# EasyEDA Pro project 前车mainboard_V3.2.epro

# Schematic mainboard_V3.2
Board Name: mainboard_V3.2; Create Date: 2025-04-06; Page Name: P1; Project Name: 主板（前车）; Schematic Name: mainboard_V3.2; Update Date: 2025-04-06; Company: 嘉立创EDA; Page Size: A4; Version: V1.0
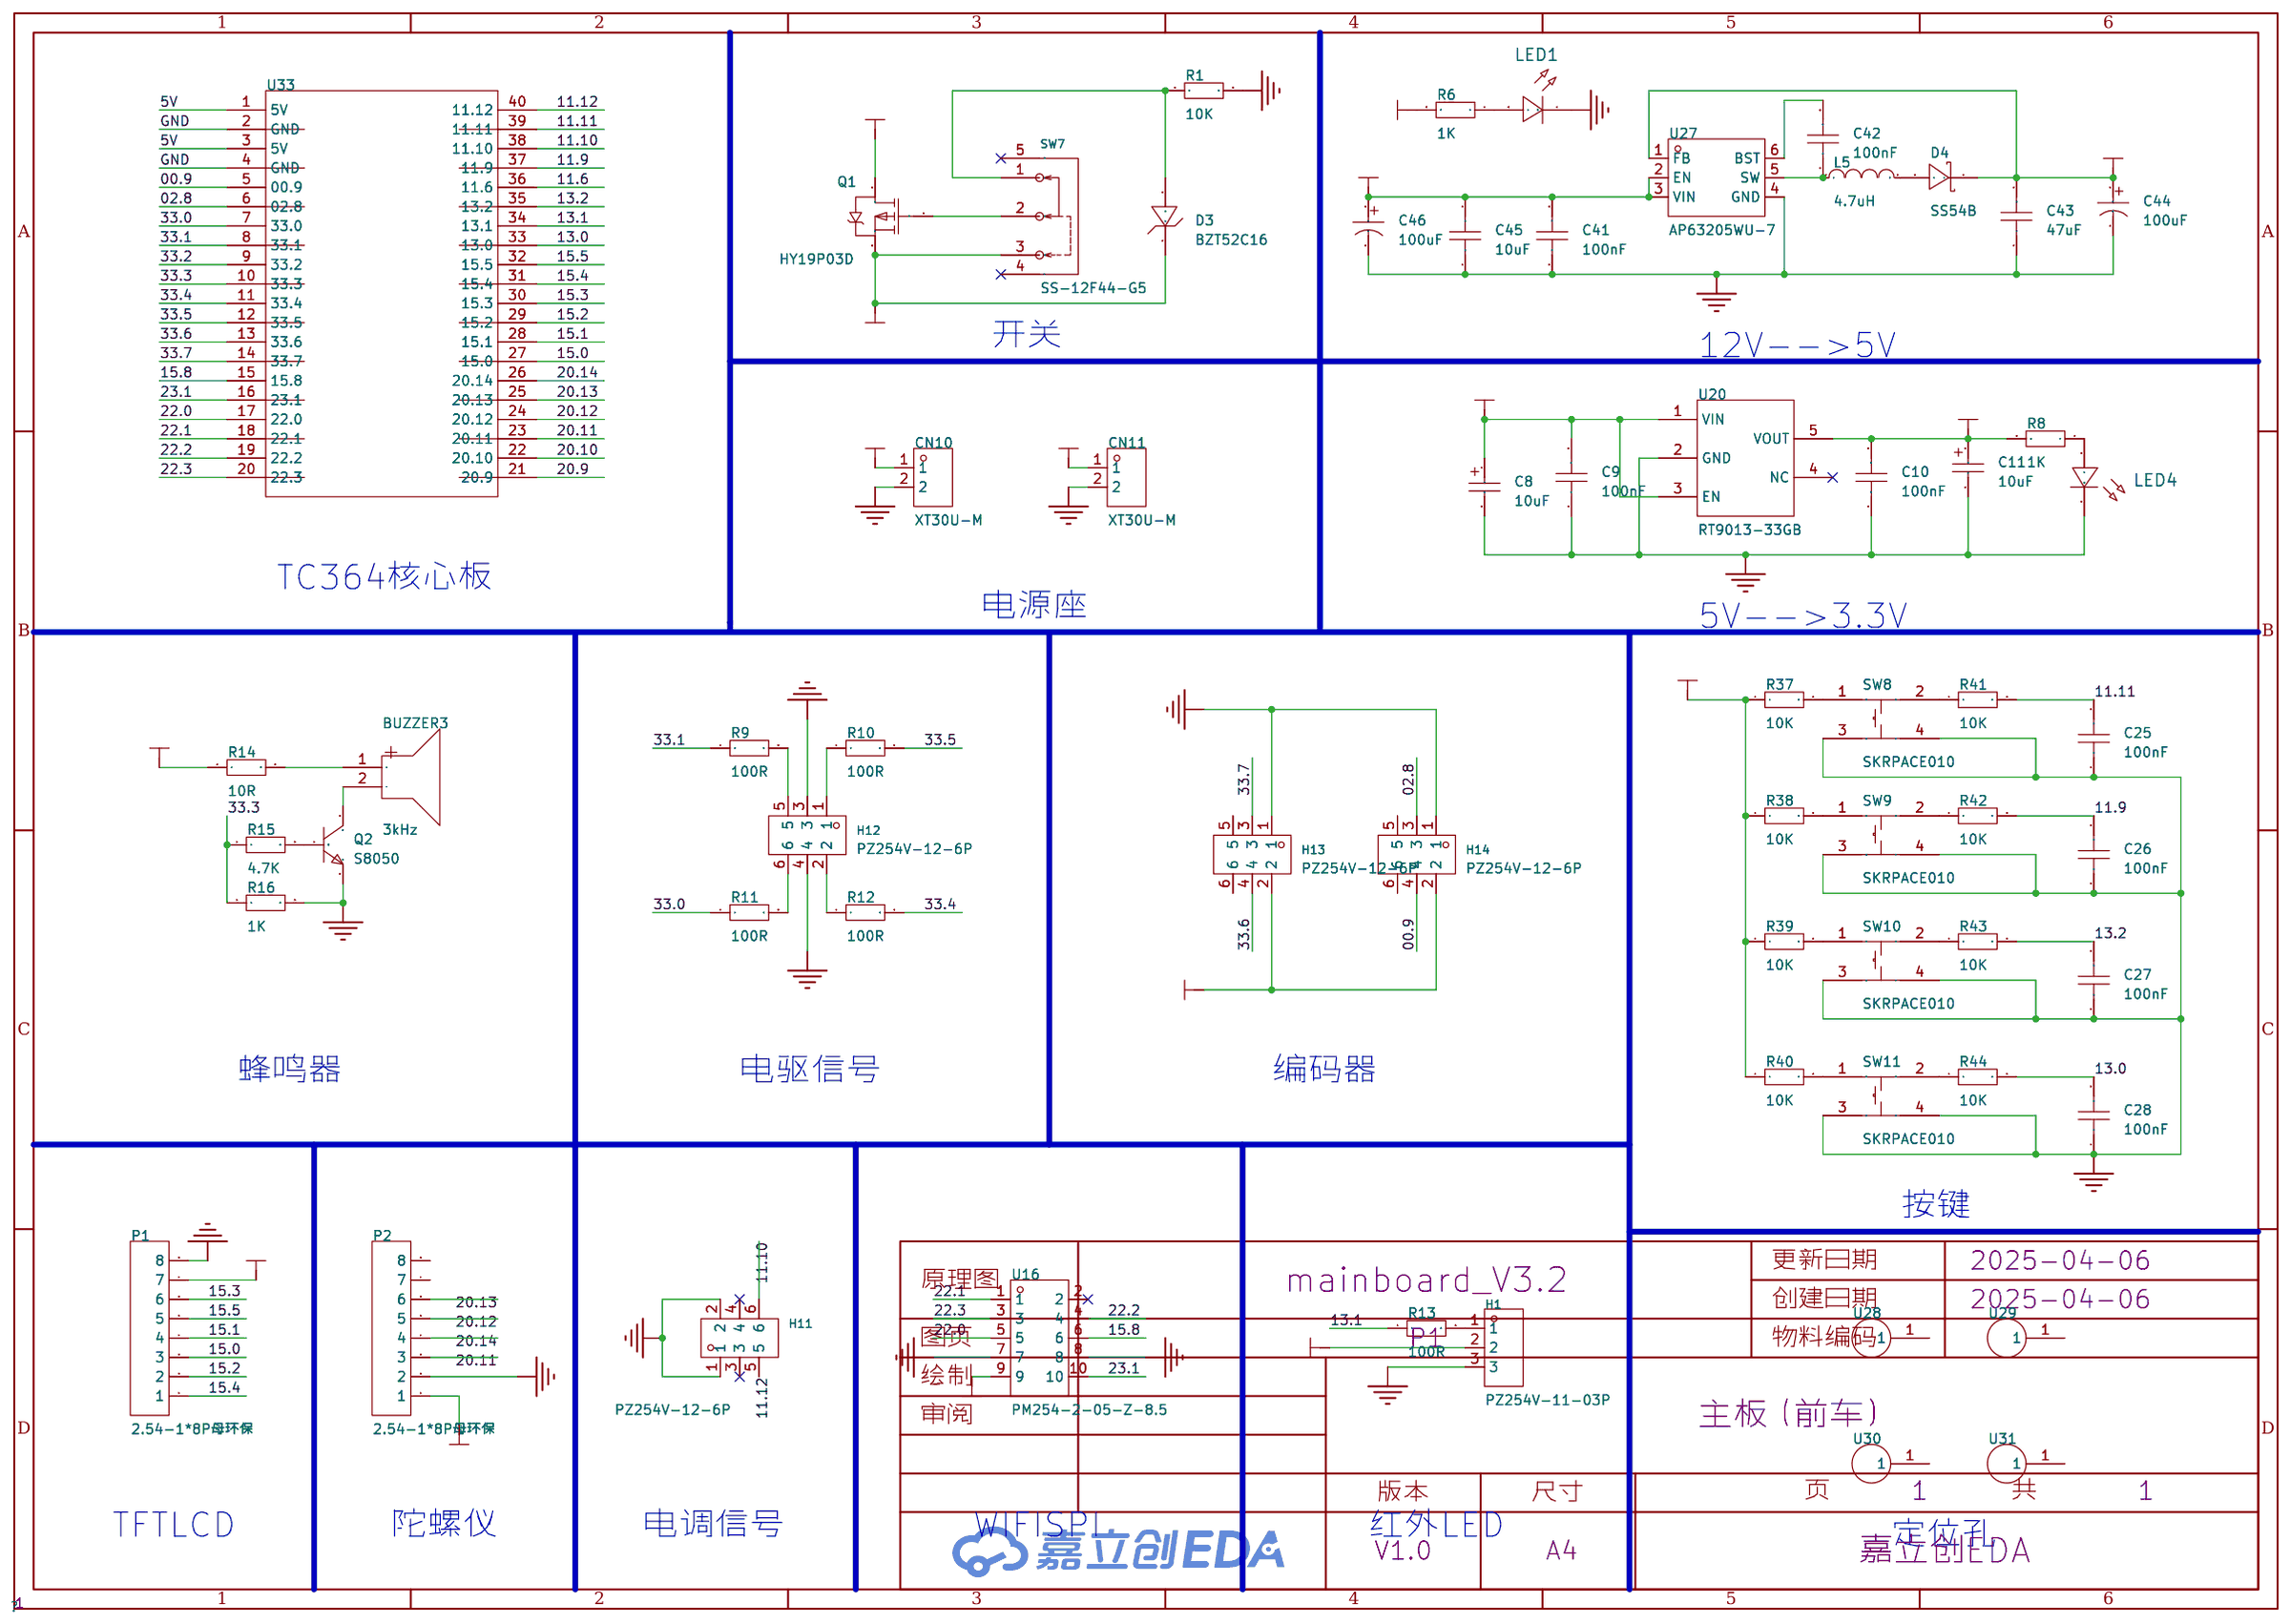
[diagram p0: schematic sheet]

## Parts
BUZZER3  3kHz  [BUZ-TH_BD9.0-P5.00-D0.6-FD]
C8  10uF  [CAP-SMD_L3.2-W1.6-RD-C7171]
C9  100nF  [C0603]
C10  100nF  [C0603]
C11  10uF  [CAP-SMD_L3.2-W1.6-RD-C7171]
C25  100nF  [C0603]
C26  100nF  [C0603]
C27  100nF  [C0603]
C28  100nF  [C0603]
C41  100nF  [C0603]
C42  100nF  [C0603]
C43  47uF  [C0805]
C44  100uF  [CAP-TH_BD6.3-P2.50-D1.0-FD]
C45  10uF  [C0603]
C46  100uF  [CAP-TH_BD6.3-P2.50-D1.0-FD]
CN10  XT30U-M  [CONN-TH_XT30U-M]
CN11  XT30U-M  [CONN-TH_XT30U-M]
D3  BZT52C16  [SOD-123_L2.7-W1.6-LS3.7-RD]
D4  SS54B  [SMB_L4.6-W3.6-LS5.3-RD]
H1  PZ254V-11-03P  [HDR-TH_3P-P2.54-V-M]
H11  PZ254V-12-6P  [HDR-TH_6P-P2.54-V-M-R2-C3-S2.54]
H12  PZ254V-12-6P  [HDR-TH_6P-P2.54-V-M-R2-C3-S2.54]
H13  PZ254V-12-6P  [HDR-TH_6P-P2.54-V-M-R2-C3-S2.54]
H14  PZ254V-12-6P  [HDR-TH_6P-P2.54-V-M-R2-C3-S2.54]
L5  4.7uH  [IND-SMD_L7.0-W6.6]
LED1  -  [LED_0603]
LED4  -  [LED_0603]
P1  2.54-1*8P母环保  [HDR-TH_8P-P2.54-V-F-1]
P2  2.54-1*8P母环保  [HDR-TH_8P-P2.54-V-F-1]
Q1  HY19P03D  [TO-252-2_L6.6-W6.1-P4.57-LS9.9-TL-CW]
Q2  S8050  [SOT-23-3_L2.9-W1.3-P1.90-LS2.4-BR]
R1  10K  [R0603]
R6  1K  [R0603]
R8  1K  [R0603]
R9  100R  [R0603]
R10  100R  [R0603]
R11  100R  [R0603]
R12  100R  [R0603]
R13  100R  [R0603]
R14  10R  [R0603]
R15  4.7K  [R0603]
R16  1K  [R0603]
R37  10K  [R0603]
R38  10K  [R0603]
R39  10K  [R0603]
R40  10K  [R0603]
R41  10K  [R0603]
R42  10K  [R0603]
R43  10K  [R0603]
R44  10K  [R0603]
SW7  SS-12F44-G5  [SW-TH_SS-12F44-G5]
SW8  SKRPACE010  [KEY-SMD_4P-L4.2-W3.2-P2.20-LS4.6]
SW9  SKRPACE010  [KEY-SMD_4P-L4.2-W3.2-P2.20-LS4.6]
SW10  SKRPACE010  [KEY-SMD_4P-L4.2-W3.2-P2.20-LS4.6]
SW11  SKRPACE010  [KEY-SMD_4P-L4.2-W3.2-P2.20-LS4.6]
U16  PM254-2-05-Z-8.5  [HDR-TH_10P-P2.54-V-F-R2-C5-S2.54]
U20  RT9013-33GB  [SOT-23-5_L3.0-W1.7-P0.95-LS2.8-BL]
U27  AP63205WU-7  [TSOT-23-6_L2.9-W1.6-P0.95-LS2.8-BL]
U28  -  [M3螺丝孔]  (no BOM)
U29  -  [M3螺丝孔]  (no BOM)
U30  -  [M3螺丝孔]  (no BOM)
U31  -  [M3螺丝孔]  (no BOM)
U33  -  [TC364_CoreBoard_V3.0]

## Library data of the parts
BUZZER3 = HNB09A03: 驱动方式:有源(内含驱动线路);构造类型:电磁式;频率:3kHz;声压(SPL):85dB@10cm;; LCSC Part Name: 电磁式有源一体蜂鸣器HNB09A03; Supplier Part: C96102; Manufacturer: 华能; Supplier Footprint: 插件,D=9mm; JLCPCB Part Class: 扩展库; Datasheet: https://atta.szlcsc.com/upload/public/pdf/source/20170522/1495448326172.pdf; Supplier: LCSC; Oscillator Circuit: 有源(内含驱动线路); Technology Type: 电磁式; Operating Voltage: 1.5V~4.5V; Current Consumption: 30mA; Sound Pressure Level (SPL): 85dB@10cm; Diameter (φD): 9mm; Height: 5.5mm; Operating Temperature: -20℃~+70℃
C8 C11 = TAJA106K016RNJ: 容值:10uF;精度:±10%;额定电压:16V;等效串联电阻:3Ω@100kHz;; LCSC Part Name: 10uF ±10% 16V; Supplier Part: C7171; Manufacturer: Kyocera AVX; Supplier Footprint: CASE-A-3216; JLCPCB Part Class: 基础库; Datasheet: https://atta.szlcsc.com/upload/public/pdf/source/20160107/1457707750344.pdf; Supplier: LCSC; Tolerance: ±10%; Rated Voltage: 16V; Equivalent Series Resistance(ESR): 3Ω@100kHz; Operating Temperature: -55℃~+125℃
C9 C10 = CC0603KRX7R9BB104: 容值:100nF;精度:±10%;额定电压:50V;材质(温度系数):X7R;; LCSC Part Name: 100nF ±10% 50V; Supplier Part: C14663; Manufacturer: YAGEO(国巨); Supplier Footprint: 0603; JLCPCB Part Class: 基础库; Datasheet: https://atta.szlcsc.com/upload/public/pdf/source/20180910/C282072_33301C7F631E79921B82A8DAC6BCC5B3.pdf; Supplier: LCSC; Tolerance: ±10%; Voltage Rated: 50V; Temperature Coefficient: X7R
C25-C28 C41 C42 C45 = CAP_0603: Supplier Footprint: 0603
C43 = CGA0805X5R476M100MT: 容值:47uF;精度:±20%;额定电压:10V;材质(温度系数):X5R;; LCSC Part Name: 47uF ±20% 10V; Supplier Part: C6119904; Manufacturer: HRE(芯声); Supplier Footprint: 0805; JLCPCB Part Class: 扩展库; Supplier: LCSC; Tolerance: ±20%; Voltage Rated: 10V; Temperature Coefficient: X5R
C44 C46 = SPZ1VM101E08O00RAXXX: 容值:100uF;精度:±20%;额定电压:35V;纹波电流:2.35A@100kHz;等效串联电阻:50mΩ@100kHz;类型:-;; LCSC Part Name: 100uF ±20% 35V; Supplier Part: C122240; Manufacturer: AISHI(艾华集团); Supplier Footprint: 插件,D6.3xL8mm; JLCPCB Part Class: 扩展库; Datasheet: https://atta.szlcsc.com/upload/public/pdf/source/20170721/C122240_1500619276730834029.pdf; Supplier: LCSC; Tolerance: ±20%; Rated Voltage: 35V; Ripple Current: 2.35A@100kHz; Equivalent Series Resistance(ESR): 50mΩ@100kHz; Lead Spacing: 2.5mm; φD: 6.3mm; L: 8mm; Lifetime @ Temp: 2000hrs@105℃; Operating Temperature: -55℃~+105℃
CN10 CN11 = XT30U-M: 类别:-;类型1:-;; LCSC Part Name: AMASS(艾迈斯)轻量版锂电池插头公头 XT30U-M; Supplier Part: C99101; Manufacturer: AMASS(艾迈斯); JLCPCB Part Class: 扩展库; Datasheet: https://atta.szlcsc.com/upload/public/pdf/source/20170606/1496716542582.pdf; Supplier: LCSC; Brand: 艾迈斯; Type: 插头; Colour: 黄色; InterfaceType: 公头
D3 = BZT52C16_C266570: 二极管配置:独立式;稳压值(标称值):16V;稳压值(范围):15.3V~17.1V;功率:500mW;精度:-;; Supplier Part: C266570; Manufacturer: BORN(伯恩半导体); Supplier Footprint: SOD-123; JLCPCB Part Class: 扩展库; Datasheet: https://atta.szlcsc.com/upload/public/pdf/source/20180820/C271262_D2D0F24DD5A81EAE2A6B8B493A94E64A.pdf; Supplier: LCSC; Diode Configuration: 独立式; Zener Voltage (Nom): 16V; Reverse Leakage Current (Ir): 100nA@11.2V; Zener Voltage (Range): 15.3V~17.1V; Power Dissipation: 500mW; Zener Impedance (Zzt): 40Ω
D4 = SS54B_C32513: 二极管配置:独立式;正向压降(Vf):550mV@5A;直流反向耐压(Vr):40V;整流电流:5A;; LCSC Part Name: 电压:40V 电流:5A; Supplier Part: C32513; Manufacturer: MDD(辰达半导体); Supplier Footprint: SMB(DO-214AA); JLCPCB Part Class: 扩展库; Datasheet: https://atta.szlcsc.com/upload/public/pdf/source/20240729/11D094B8AB06134CE012673FC230C171.pdf; Supplier: LCSC; Diode Configuration: 独立式; Forward Voltage (Vf@If): 550mV@5A; Reverse Voltage (Vr): 40V; Rectified Current: 5A; Reverse Leakage Current (Ir): 1mA@40V
H1 = PZ254V-11-03P: 排数:单排;总PIN位数:3;间距:2.54mm;插针结构:1x3P;行距:-;安装类型:直插;圆针/方针:方针;额定电流:3A;额定电压:250V;配合针长度:6mm;塑高:2.5mm;端接针长度:3mm;工作温度范围:-40℃~+105℃;颜色:黑色;; LCSC Part Name: 2.54mm 1x3P 直插 方针; Supplier Part: C2937625; Manufacturer: XFCN(兴飞); Supplier Footprint: 直插,P=2.54mm; JLCPCB Part Class: 扩展库; Datasheet: 2022-07-12/581362A/62b9d00620994b3696be7eb4af85ad72/双排排针和单排排针.pdf; Supplier: LCSC; Number of Rows: 单排; Number of Pins: 3; Pitch: 2.54mm; Pin Structure: 1x3P; Mounting Type: 直插; Circluar Pins/Square Pins: 方针; Current Rating (Max): 3A; Voltage Rating (Max): 250V; Length of Mating Pin: 6mm; Insulation Height: 2.5mm; Length of End Connection Pin: 3mm; Operating Temperature Range: -40℃~+105℃; Color: 黑色
H11-H14 = PZ254V-12-6P: 排数:双排;总PIN位数:6P;间距:2.54mm;插针结构:2x3P;行距:2.54mm;安装类型:直插;圆针/方针:方针;额定电流:-;额定电压:-;配合针长度:6mm;塑高:2.5mm;端接针长度:3mm;触头材质:黄铜;触头镀层:-;工作温度范围:-40℃~+105℃;颜色:黑色;; LCSC Part Name: 2.54mm 2x3P 直插 方针; Supplier Part: C492420; Manufacturer: XFCN(兴飞); Supplier Footprint: 插件,P=2.54mm; JLCPCB Part Class: Extended Part; Datasheet: https://atta.szlcsc.com/upload/public/pdf/source/20200309/C492420_BAECB307B001054C09D200388220EAE6.pdf; Supplier: LCSC; Number of Rows: 双排; Number of Pins: 6P; Pitch: 2.54mm; Pin Structure: 2x3P; Row Spacing: 2.54mm; Mounting Type: 直插; Circluar Pins/Square Pins: 方针; Length of Mating Pin: 6mm; Insulation Height: 2.5mm; Length of End Connection Pin: 3mm; Contact Material: 黄铜; Operating Temperature Range: -40℃~+105℃; Color: 黑色
L5 = FXL0630-4R7-M: 电感值:4.7uH;精度:±20%;额定电流:6A;饱和电流(Isat):9A;类型:一体成型电感;; LCSC Part Name: 4.7uH ±20% 9A; Supplier Part: C167220; Manufacturer: cjiang(长江微电); Supplier Footprint: SMD,6.6x7mm; JLCPCB Part Class: Extended Part; Datasheet: https://atta.szlcsc.com/upload/public/pdf/source/20240426/3189EA8206330E2108542F9E34E540E7.pdf; Supplier: LCSC; Tolerance: ±20%; Rated Current: 6A; Saturation Current (Isat): 9A; DC Resistance (DCR): 33mΩ; Type: 一体成型电感
LED1 LED4 = LED_0603-R: Supplier Footprint: 0603
P1 P2 = 2.54-1*8P母环保: 插孔结构:1x8P;间距:2.54mm;行距:-;安装类型:直插;排数:单排;总孔位数:8P;塑高:-;触头材质:-;触头镀层:-;; LCSC Part Name: 间距:2.54mm 1x8P 直插; Supplier Part: C27438; Manufacturer: BOOMELE(博穆精密); Supplier Footprint: 插件,P=2.54mm; JLCPCB Part Class: Extended Part; Datasheet: https://atta.szlcsc.com/upload/public/pdf/source/20231221/1CA800C6799ED97958773716FAA1BFFE.pdf; Supplier: LCSC; Holes Structure: 1x8P; Pitch: 2.54mm; Mounting Type: 直插; Number of Rows: 单排; Number of Holes: 8P
Q1 = HY19P03D: 类型:P沟道;漏源电压(Vdss):30V;连续漏极电流(Id):90A;功率(Pd):50W;导通电阻(RDS(on)@Vgs,Id):6mΩ@10V,45A;阈值电压(Vgs(th)@Id):3V@250uA;; LCSC Part Name: P沟道 30V 90A; Supplier Part: C122492; Manufacturer: HUAYI(华羿微); Supplier Footprint: TO-252-2; JLCPCB Part Class: 扩展库; Datasheet: https://atta.szlcsc.com/upload/public/pdf/source/20170728/C122492_1501225751911848809.pdf; Supplier: LCSC; Type: P沟道; Drain Source Voltage (Vdss): 30V; Continuous Drain Current (Id): 90A; Power Dissipation (Pd): 50W; Drain Source On Resistance (RDS(on)@Vgs,Id): 6mΩ@10V,45A; Gate Threshold Voltage (Vgs(th)@Id): 3V@250uA
Q2 = S8050_C2891804: 晶体管类型:NPN;集电极电流(Ic):500mA;集射极击穿电压(Vceo):25V;功率(Pd):300mW;; LCSC Part Name: 耐压:25V 电流:500mA NPN; Supplier Part: C2891804; Manufacturer: YONGYUTAI(永裕泰); Supplier Footprint: SOT-23; JLCPCB Part Class: 扩展库; Datasheet: https://atta.szlcsc.com/upload/public/pdf/source/20210901/5347316A10609C628D4D69AE01446E5B.pdf; Supplier: LCSC; Transistor Type: NPN; Collector Current (Ic): 500mA; Collector-Emitter Breakdown Voltage (Vceo): 25V; Power Dissipation (Pd): 300mW; Collector Cut-Off Current (Icbo): 1uA; Collector-Emitter Saturation Voltage (VCE(sat)@Ic,Ib): 500mV@500mA,50mA; Operating Temperature: +150℃@(Tj)
R1 R6 R8-R16 R37-R44 = Res_0603: Supplier Footprint: 0603
SW7 = SS-12F44-G5_C136718: 额定电流(DC):-;额定电压(DC):-;额定电流(AC):-;额定电压(AC):-;电路结构:单刀双掷;安装方式:直插;机械寿命:5千次;; LCSC Part Name: 直插双档 滑动开关; Supplier Part: C136718; Manufacturer: 韩国韩荣; Supplier Footprint: 插件; JLCPCB Part Class: 扩展库; Datasheet: https://atta.szlcsc.com/upload/public/pdf/source/20171123/C136718_15114108132111137440.pdf; Supplier: LCSC; Circuit: 单刀双掷; Mounting Style: 直插; Mechanical Life: 5千次; Actuator Style: 矩形柱状; Pin Style: PC引脚; Operating Temperature: -25℃~+70℃; Switch Height: 11mm
SW8-SW11 = SKRPACE010: 电路结构:单刀单掷;按钮形状:椭圆形按钮;安装方式:立贴;开关长度:4.2mm;开关宽度:3.2mm;开关高度:2.5mm;触点电流:50mA;额定电压(DC):16V;带灯:-;机械寿命:-;; LCSC Part Name: 4.2*3.2*2.5mm 立贴 轻触开关; Supplier Part: C139797; Manufacturer: ALPSALPINE(阿尔卑斯阿尔派); Supplier Footprint: SMD; JLCPCB Part Class: 扩展库; Datasheet: https://atta.szlcsc.com/upload/public/pdf/source/20171113/C139797_15105612676371115729.pdf; Supplier: LCSC; Circuit: 单刀单掷; Actuator Style: 椭圆形按钮; Mounting Style: 立贴; Switch Length: 4.2mm; Switch Width: 3.2mm; Switch Height: 2.5mm; Contact Current: 50mA; Voltage Rating (DC): 16V
U16 = PM254-2-05-Z-8.5: 排数:双排;总孔位数:10P;间距:2.54mm;插孔结构:2x5P;行距:2.54mm;安装类型:直插;圆孔/方孔:方孔;额定电流:3A;额定电压:-;插孔方向:顶部;塑高:8.5mm;工作温度范围:-40℃~+105℃;; LCSC Part Name: 间距:2.54mm 2x5P 直插; Supplier Part: C2897406; Manufacturer: HCTL(华灿天禄); Supplier Footprint: 插件,P=2.54mm; JLCPCB Part Class: 扩展库; Datasheet: https://atta.szlcsc.com/upload/public/pdf/source/20230609/3D36CA2C1BFC9FD1C3F709AD9DFEB9C2.pdf; Supplier: LCSC; Number of Rows: 双排; Number of Holes: 10P; Pitch: 2.54mm; Holes Structure: 2x5P; Row Spacing: 2.54mm; Mounting Type: 直插; Circular Hole / Square Hole: 方孔; Current Rating (Max): 3A; Holes Direction: 顶部; Insulation Height: 8.5mm; Operating Temperature Range: -40℃~+105℃
U20 = RT9013-33GB: 输出类型:固定;输出极性:正;最大输入电压:5.5V;输出电压:3.3V;输出电流:500mA;电源纹波抑制比(PSRR):50dB@(10kHz);; LCSC Part Name: 输入5.5V 输出3.3V 500mA; Supplier Part: C47773; Manufacturer: RICHTEK(立锜); Supplier Footprint: SOT-23-5; JLCPCB Part Class: 扩展库; Datasheet: https://atta.szlcsc.com/upload/public/pdf/source/20150504/1457707282459.pdf; Supplier: LCSC; Output Type: 固定; Output Polarity: 正; Number of Outputs: 1; Maximum Input Voltage: 5.5V; Output Voltage: 3.3V; Dropout Voltage: 400mV@(500mA); Quiescent Current (Ground Current): 50uA; Output Current: 500mA; Power Supply Rejection Ratio (PSRR): 50dB@(10kHz); Operating Temperature: -40℃~+85℃
U27 = AP63205WU-7: 功能类型:降压型;输出类型:固定;输入电压:3.8V~32V;输出电压:5V;输出电流:2A;; LCSC Part Name: 3.8V至32V输入、2A低静态电流同步降压转换器，增强EMI抑制; Supplier Part: C2071056; Manufacturer: DIODES(美台); Supplier Footprint: TSOT-23-6; JLCPCB Part Class: 扩展库; Datasheet: https://atta.szlcsc.com/upload/public/pdf/source/20210622/C780769_099C67289BD3EC61AAFB52D8B07125B3.pdf; Supplier: LCSC; Function: 降压型; Output Type: 固定; Input Voltage: 3.8V~32V; Output Voltage: 5V; Output Current: 2A; Switching Frequency: 1.1MHz; Operating Temperature: -40℃~+85℃@(TA); Synchronous Rectification: 是; Number of Outputs: 1; Topology: 降压式; Quiescent Current (Iq): 22uA; Switch tube (built-in/external): 内置
U28-U31 = M3螺丝孔
U33 = TC364_CoreBoard_V3.0

## Nets
3V3: C10.2 C11.1 H13.2 H14.2 P1.7 P2.1 R8.2 R14.1 R37.1 R38.1 R39.1 R40.1 U20.5(VOUT)
5V: C8.1 C9.2 C43.2 C44.1 D4.1(K) H1.2 R6.2 U16.9 U20.1(VIN) U20.3(EN) U27.1(FB) U33.1(5V) U33.3(5V)
GND: C8.2 C9.1 C10.1 C11.2 C25.1 C26.1 C27.1 C28.1 C41.1 C43.1 C44.2 C45.1 C46.2 CN10.2 CN11.2 H1.3 H11.1 H11.2 H12.3 H12.4 H13.1 H14.1 LED1.1(C) LED4.1(C) P1.8 P2.2 Q2.2(E) R1.2 R16.2 SW8.3 SW8.4 SW9.3 SW9.4 SW10.3 SW10.4 SW11.3 SW11.4 U16.7 U16.8 U20.2(GND) U27.4(GND) U33.2(GND) U33.4(GND)
VCCBAT: C41.2 C45.2 C46.1 CN11.1 Q1.2(D) U27.2(EN) U27.3(VIN)
VIN: CN10.1 D3.1 Q1.3(S) SW7.3
00.9: H14.4 U33.5(00.9)
02.8: H14.3 U33.6(02.8)
11.6: U33.36(11.6)
11.9: C26.2 R42.2 U33.37(11.9)
11.10: H11.6 U33.38(11.10)
11.11: C25.2 R41.2 U33.39(11.11)
11.12: H11.5 U33.40(11.12)
13.0: C28.2 R44.2 U33.33(13.0)
13.1: R13.1 U33.34(13.1)
13.2: C27.2 R43.2 U33.35(13.2)
15.0: P1.3 U33.27(15.0)
15.1: P1.4 U33.28(15.1)
15.2: P1.2 U33.29(15.2)
15.3: P1.6 U33.30(15.3)
15.4: P1.1 U33.31(15.4)
15.5: P1.5 U33.32(15.5)
15.8: U16.6 U33.15(15.8)
20.9: U33.21(20.9)
20.10: U33.22(20.10)
20.11: P2.3 U33.23(20.11)
20.12: P2.5 U33.24(20.12)
20.13: P2.6 U33.25(20.13)
20.14: P2.4 U33.26(20.14)
22.0: U16.5 U33.17(22.0)
22.1: U16.1 U33.18(22.1)
22.2: U16.4 U33.19(22.2)
22.3: U16.3 U33.20(22.3)
23.1: U16.10 U33.16(23.1)
33.0: R11.1 U33.7(33.0)
33.1: R9.1 U33.8(33.1)
33.2: U33.9(33.2)
33.3: R15.1 R16.1 U33.10(33.3)
33.4: R12.2 U33.11(33.4)
33.5: R10.2 U33.12(33.5)
33.6: H13.4 U33.13(33.6)
33.7: H13.3 U33.14(33.7)
$1N756: Q1.1(G) SW7.2
$1N757: D3.2 R1.1 SW7.1
$1N1936: LED4.2(A) R8.1
$1N2039: H1.1 R13.2
$1N2442: BUZZER3.1(+) R14.2
$1N2446: BUZZER3.2(-) Q2.3(C)
$1N2966: H12.5 R9.2
$1N2968: H12.1 R10.1
$1N2969: H12.6 R11.2
$1N2971: H12.2 R12.1
$1N3489: R37.2 SW8.1
$1N3490: R38.2 SW9.1
$1N3491: R39.2 SW10.1
$1N3492: R40.2 SW11.1
$1N3494: R42.1 SW9.2
$1N3495: R43.1 SW10.2
$1N3496: R44.1 SW11.2
$1N3497: R41.1 SW8.2
$1N3677: Q2.1(B) R15.2
$1N27934: LED1.2(A) R6.1
$1N27939: C42.1 L5.1 U27.5(SW)
$1N27940: C42.2 U27.6(BST)
$1N27942: D4.2(A) L5.2

Not connected (* = marked no-connect by the designer): H11 3* 4*; H13 5 6; H14 5 6; P2 7 8; SW7 4* 5*; U16 2*; U20 4(NC)*; U28 1; U29 1; U30 1; U31 1

## Notes on the sheet
- 开关
- 12V-->5V
- TC364核心板
- 电源座
- 5V-->3.3V
- 蜂鸣器
- 电驱信号
- 编码器
- 按键
- TFTLCD
- 陀螺仪
- 电调信号
- WIFISPI
- 红外LED
- 定位孔

# Board mainboard_V3.2
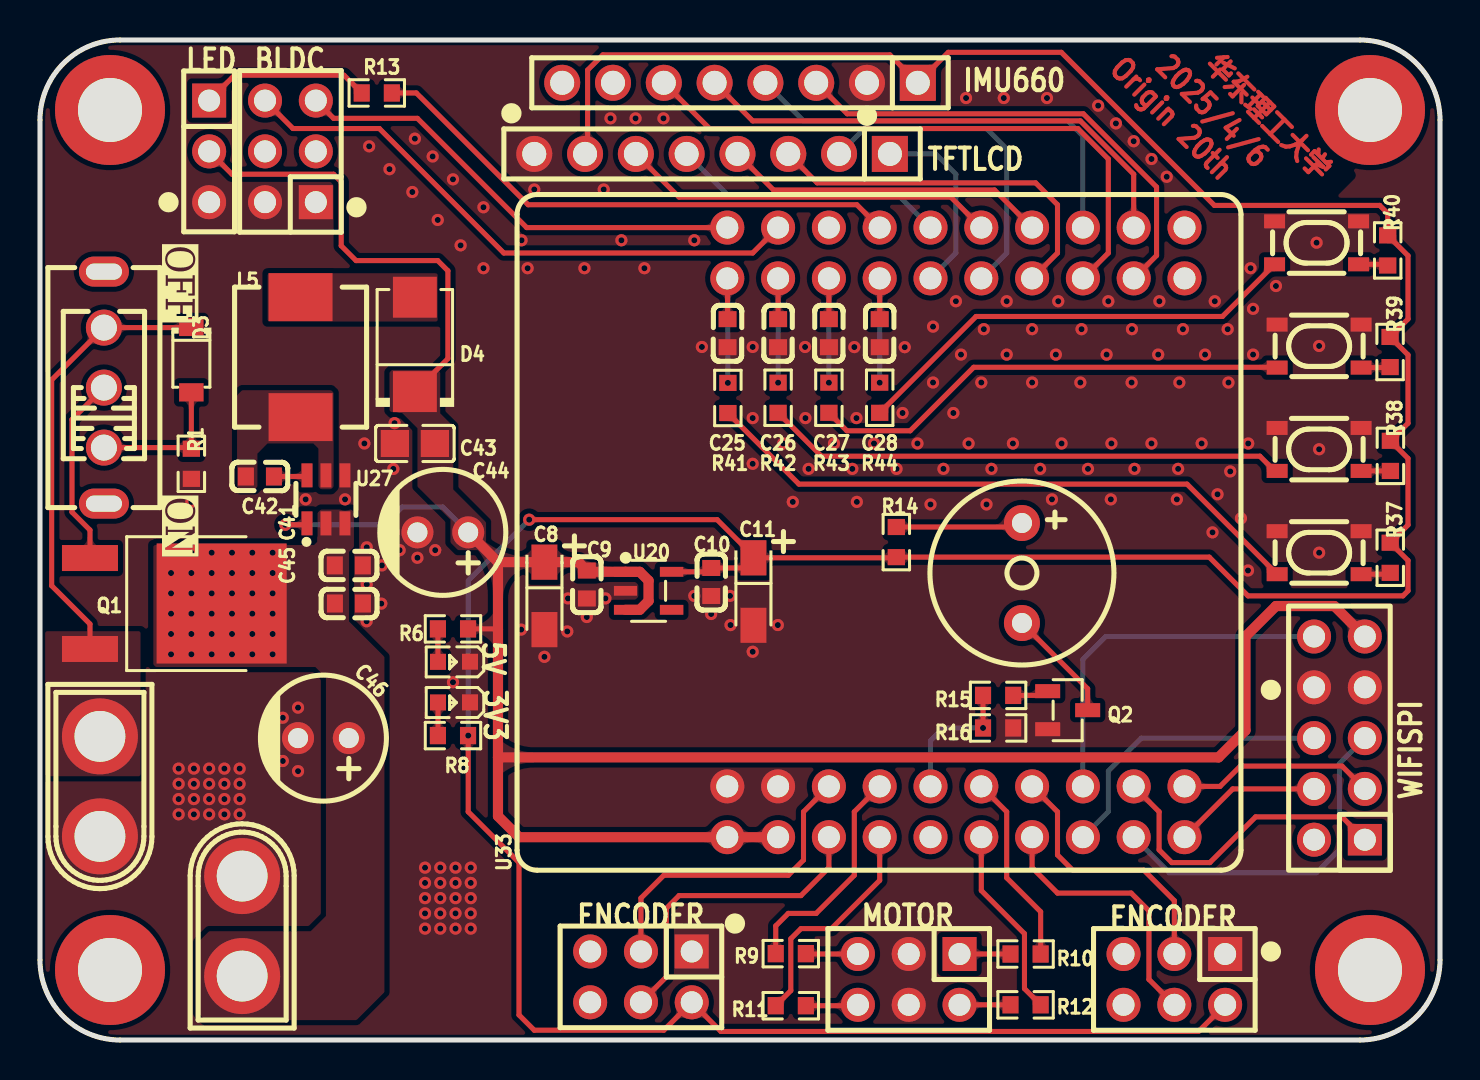
[diagram p1: board, top side]
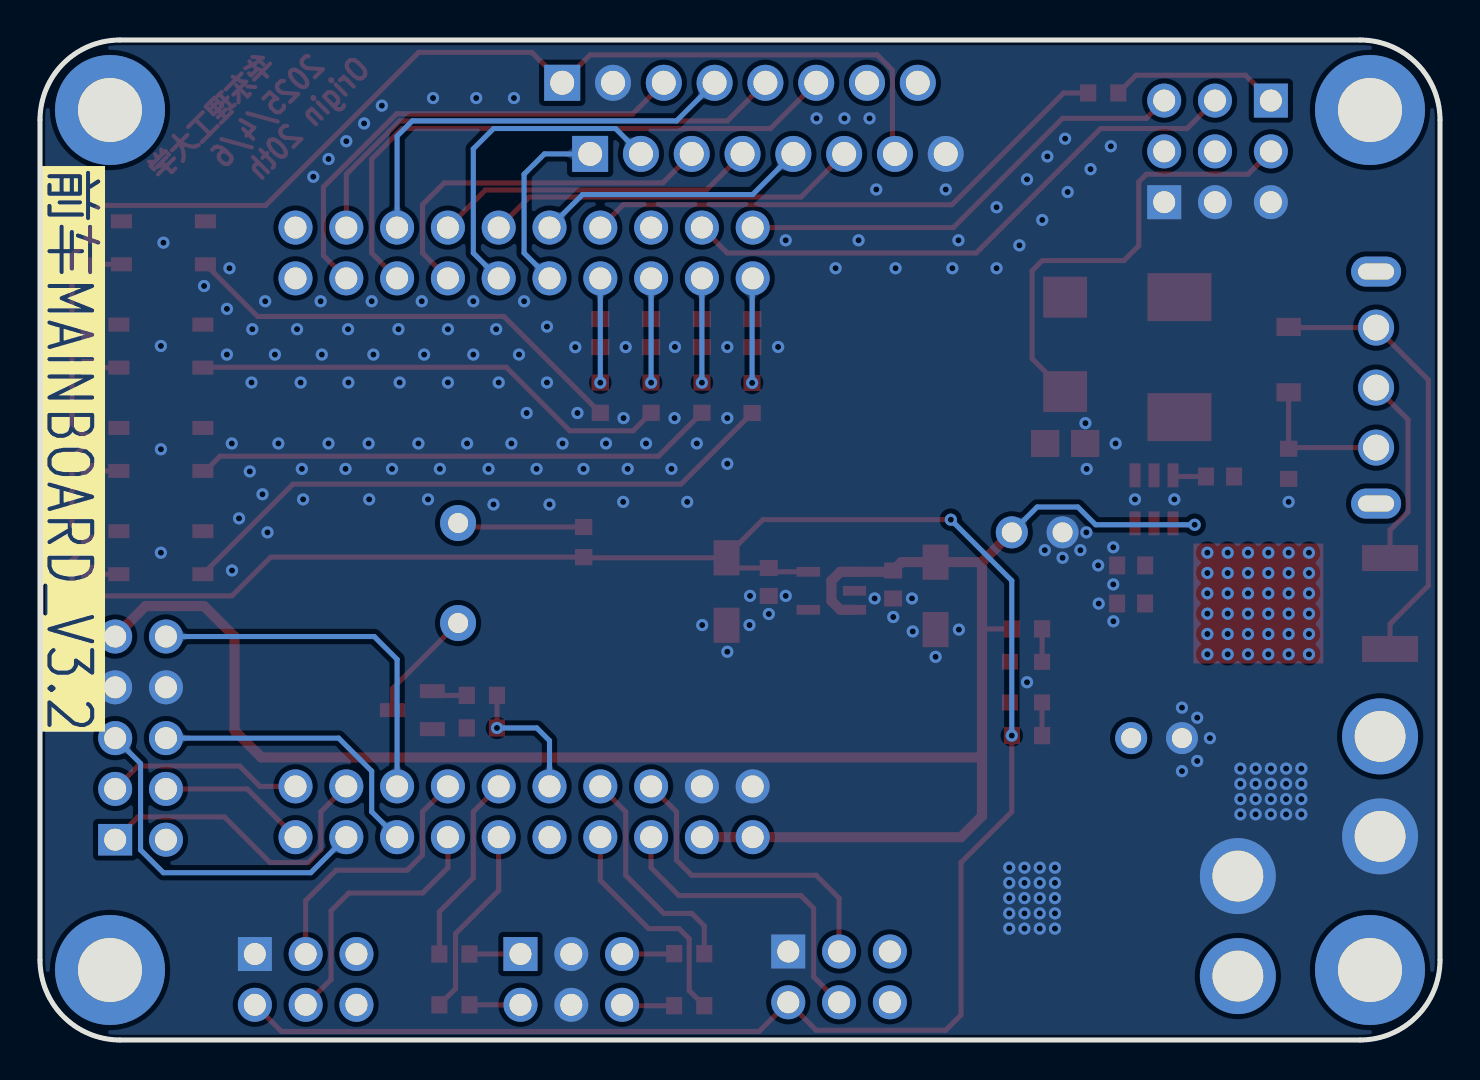
[diagram p2: board, bottom side, seen from below]

Outline 70 x 50 mm; copper layers: Top Layer, Bottom Layer. Coordinates in mm from the lower left corner of the outline.
Outline path: 0,46 0,4 arc(1.17,1.17) 4,0 66,0 arc(68.83,1.17) 70,4 70,46 arc(68.83,48.83) 66,50 4,50 arc(1.17,48.83) 0,46
Stack: Top Layer 0.035mm / Dielectric1 1.51mm FR4 er 4.5 / Bottom Layer 0.035mm

## Design rules (mm)
template: 4层
spacing copperThickness1oz (default): track to track 0.102, other pairs 0.152 to 0.3
spacing copperThickness2oz: track to track 0.203, other pairs 0.152 to 0.3
spacing copperThicknessInner0.5oz: track to track 0.089, other pairs 0.152 to 0.3
track width copperThickness1oz (default): min 0.102, default 0.254, max 2.54
track width copperThickness2oz: min 0.203, default 0.254, max 2.54
track width copperThickness0.5oz: min 0.089, default 0.254, max 2.54
differential pair differentialPair (default): width min 0.127, default 0.254, max 2.54; gap min 0.152, default 0.152
via viaSize (default): diameter min 0.3, default 0.61, max 10; hole min 0.2, default 0.305, max 6.3

## Placement (name value [footprint] x y rotation side)
BUZZER3  3kHz  [BUZ-TH_BD9.0-P5.00-D0.6-FD]  49.1 23.35 270 top
C8  10uF  [CAP-SMD_L3.2-W1.6-RD-C7171]  25.22 22.21 270 top
C9  100nF  [C0603]  27.34 22.77 90 top
C10  100nF  [C0603]  33.56 22.9 90 top
C11  10uF  [CAP-SMD_L3.2-W1.6-RD-C7171]  35.67 22.42 270 top
C25  100nF  [C0603]  34.38 35.34 90 top
C26  100nF  [C0603]  36.91 35.34 90 top
C27  100nF  [C0603]  39.44 35.34 90 top
C28  100nF  [C0603]  41.99 35.34 90 top
C41  100nF  [C0603]  15.44 23.73 180 top
C42  100nF  [C0603]  11 28.17 0 top
C43  47uF  [C0805]  18.74 29.83 0 top
C44  100uF  [CAP-TH_BD6.3-P2.50-D1.0-FD]  20.14 25.38 180 top
C45  10uF  [C0603]  15.44 21.83 180 top
C46  100uF  [CAP-TH_BD6.3-P2.50-D1.0-FD]  14.17 15.09 180 top
CN10  XT30U-M  [CONN-TH_XT30U-M]  3 12.68 270 top
CN11  XT30U-M  [CONN-TH_XT30U-M]  10.11 5.7 90 top
D3  BZT52C16  [SOD-123_L2.7-W1.6-LS3.7-RD]  7.57 34.02 270 top
D4  SS54B  [SMB_L4.6-W3.6-LS5.3-RD]  18.74 34.78 90 top
H1  PZ254V-11-03P  [HDR-TH_3P-P2.54-V-M]  8.46 44.43 270 top
H11  PZ254V-12-6P  [HDR-TH_6P-P2.54-V-M-R2-C3-S2.54]  12.52 44.43 90 top
H12  PZ254V-12-6P  [HDR-TH_6P-P2.54-V-M-R2-C3-S2.54]  43.44 3.03 180 top
H13  PZ254V-12-6P  [HDR-TH_6P-P2.54-V-M-R2-C3-S2.54]  56.72 3.03 180 top
H14  PZ254V-12-6P  [HDR-TH_6P-P2.54-V-M-R2-C3-S2.54]  30.05 3.16 180 top
L5  4.7uH  [IND-SMD_L7.0-W6.6]  13.03 34.14 90 top
LED1  -  [LED_0603]  20.65 18.9 180 top
LED4  -  [LED_0603]  20.65 16.87 180 top
P1  2.54-1*8P母环保  [HDR-TH_8P-P2.54-V-F-1]  33.6 44.3 180 top
P2  2.54-1*8P母环保  [HDR-TH_8P-P2.54-V-F-1]  35 47.86 180 top
Q1  HY19P03D  [TO-252-2_L6.6-W6.1-P4.57-LS9.9-TL-CW]  5.79 21.83 0 top
Q2  S8050  [SOT-23-3_L2.9-W1.3-P1.90-LS2.4-BR]  51.38 16.49 180 top
R1  10K  [R0603]  7.57 28.81 270 top
R6  1K  [R0603]  20.65 20.56 0 top
R8  1K  [R0603]  20.65 15.22 0 top
R9  100R  [R0603]  37.54 4.32 0 top
R10  100R  [R0603]  49.28 4.3 0 top
R11  100R  [R0603]  37.54 1.71 0 top
R12  100R  [R0603]  49.28 1.76 0 top
R13  100R  [R0603]  16.84 47.35 180 top
R14  10R  [R0603]  42.82 24.9 90 top
R15  4.7K  [R0603]  47.91 17.23 0 top
R16  1K  [R0603]  47.91 15.6 0 top
R37  10K  [R0603]  67.51 24.11 270 top
R38  10K  [R0603]  67.52 29.21 270 top
R39  10K  [R0603]  67.5 34.4 270 top
R40  10K  [R0603]  67.38 39.48 270 top
R41  10K  [R0603]  34.39 32.1 90 top
R42  10K  [R0603]  36.91 32.11 90 top
R43  10K  [R0603]  39.44 32.11 90 top
R44  10K  [R0603]  41.99 32.11 90 top
SW7  SS-12F44-G5  [SW-TH_SS-12F44-G5]  3.2 32.62 90 top
SW8  SKRPACE010  [KEY-SMD_4P-L4.2-W3.2-P2.20-LS4.6]  63.96 24.36 180 top
SW9  SKRPACE010  [KEY-SMD_4P-L4.2-W3.2-P2.20-LS4.6]  63.96 29.53 180 top
SW10  SKRPACE010  [KEY-SMD_4P-L4.2-W3.2-P2.20-LS4.6]  63.96 34.69 180 top
SW11  SKRPACE010  [KEY-SMD_4P-L4.2-W3.2-P2.20-LS4.6]  63.83 39.86 180 top
U16  PM254-2-05-Z-8.5  [HDR-TH_10P-P2.54-V-F-R2-C5-S2.54]  64.97 15.09 90 top
U20  RT9013-33GB  [SOT-23-5_L3.0-W1.7-P0.95-LS2.8-BL]  30.43 22.46 270 top
U27  AP63205WU-7  [TSOT-23-6_L2.9-W1.6-P0.95-LS2.8-BL]  14.3 27.03 0 top
U28  -  [M3螺丝孔]  3.5 3.5 0 top
U29  -  [M3螺丝孔]  66.5 3.5 0 top
U30  -  [M3螺丝孔]  3.5 46.5 0 top
U31  -  [M3螺丝孔]  66.5 46.5 0 top
U33  -  [TC364_CoreBoard_V3.0]  43 25.38 90 top

## Footprints (pads in the part's own frame, mm; a bottom-side part is the same pattern mirrored in y, then rotated)
BUZ-TH_BD9.0-P5.00-D0.6-FD
  round 1.8 hole 1: 1(-2.5,0) 2(2.5,0)
C0603
  rect 0.8x0.9 smd: 1(-0.7,0) 2(0.7,0)
C0805
  rect 1.41x1.35 smd: 1(-1,0) 2(1,0)
CAP-SMD_L3.2-W1.6-RD-C7171
  rect 1.758x1.296 smd: 1(-1.687,0) 2(1.687,0)
CAP-TH_BD6.3-P2.50-D1.0-FD
  round 1.6 hole 1: 1(-1.27,0) 2(1.27,0)
CONN-TH_XT30U-M
  round 3.8 hole 2.54: 1(-2.5,0) 2(2.5,0)
HDR-TH_3P-P2.54-V-M
  rect 1.7x1.7 hole 1.1: 1(-2.54,0)
  round 1.7 hole 1.1: 2(0,0) 3(2.54,0)
HDR-TH_6P-P2.54-V-M-R2-C3-S2.54
  rect 1.7x1.7 hole 1.1: 1(-2.54,-1.27)
  round 1.7 hole 1.1: 2(-2.54,1.27) 3(0,-1.27) 4(0,1.27) 5(2.54,-1.27) 6(2.54,1.27)
HDR-TH_8P-P2.54-V-F-1
  rect 1.8x1.8 hole 1.2: 1(-8.89,0)
  round 1.8 hole 1.2: 2(-6.35,0) 3(-3.81,0) 4(-1.27,0) 5(1.27,0) 6(3.81,0) 7(6.35,0) 8(8.89,0)
HDR-TH_10P-P2.54-V-F-R2-C5-S2.54
  rect 1.575x1.7 hole 1.1: 1(-5.08,-1.27)
  round 1.7 hole 1.1: 2(-5.08,1.27) 3(-2.54,-1.27) 4(-2.54,1.27) 5(0,-1.27) 6(0,1.27) 7(2.54,-1.27) 8(2.54,1.27) 9(5.08,-1.27) 10(5.08,1.27)
IND-SMD_L7.0-W6.6
  rect 2.4x3.2 smd: 1(-3,0) 2(3,0)
KEY-SMD_4P-L4.2-W3.2-P2.20-LS4.6
  rect 1.05x0.7 smd: 1(-2.1,1.075) 2(2.1,1.075) 3(-2.1,-1.075) 4(2.1,-1.075)
LED_0603
  rect 0.8x0.8 smd: 1(-0.851,-0.01) 2(0.75,-0.005)
M3螺丝孔
  round 5.5 hole 3.2: 1(0,0)
R0603
  rect 0.806x0.864 smd: 1(-0.753,0) 2(0.753,0)
SMB_L4.6-W3.6-LS5.3-RD
  rect 2.047x2.192 smd: 1(-2.361,0) 2(2.361,0)
SOD-123_L2.7-W1.6-LS3.7-RD
  rect 0.91x1.22 smd: 1(-1.635,0) 2(1.635,0)
SOT-23-3_L2.9-W1.3-P1.90-LS2.4-BR
  rect 1.25x0.7 smd: 1(1,-0.95) 2(1,0.95) 3(-1,0)
SOT-23-5_L3.0-W1.7-P0.95-LS2.8-BL
  rect 0.49x1.157 smd: 1(-0.95,-1.153) 2(0,-1.153) 3(0.95,-1.153)
  rect 0.49x1.175 smd: 4(0.95,1.153) 5(-0.95,1.153)
SW-TH_SS-12F44-G5
  round 1.8 hole 1.3: 1(-3,0) 2(0,0) 3(3,0)
  oval 1.5x2.5 hole 0.8x1.8: 4(5.8,0) 5(-5.8,0)
TC364_CoreBoard_V3.0
  round 1.7 hole 1.1: 1(-15.24,8.636) 2(-12.7,8.636) 3(-15.24,6.096) 4(-12.7,6.096) 5(-15.24,3.556) 6(-12.7,3.556) 7(-15.24,1.016) 8(-12.7,1.016) 9(-15.24,-1.524) 10(-12.7,-1.524) 11(-15.24,-4.064) 12(-12.7,-4.064) 13(-15.24,-6.604) 14(-12.7,-6.604) 15(-15.24,-9.144) 16(-12.7,-9.144) 17(-15.24,-11.684) 18(-12.7,-11.684) 19(-15.24,-14.224) 20(-12.7,-14.224) 21(12.7,-14.224) 22(15.24,-14.224) 23(12.7,-11.684) 24(15.24,-11.684) 25(12.7,-9.144) 26(15.24,-9.144) 27(12.7,-6.604) 28(15.24,-6.604) 29(12.7,-4.064) 30(15.24,-4.064) 31(12.7,-1.524) 32(15.24,-1.524) 33(12.7,1.016) 34(15.24,1.016) 35(12.7,3.556) 36(15.24,3.556) 37(12.7,6.096) 38(15.24,6.096) 39(12.7,8.636) 40(15.24,8.636)
TO-252-2_L6.6-W6.1-P4.57-LS9.9-TL-CW
  rect 2.8x1.3 smd: 1(-3.292,2.273) 3(-3.292,-2.273)
  rect 6.5x6 smd: 2(3.292,0)
TSOT-23-6_L2.9-W1.6-P0.95-LS2.8-BL
  rect 0.55x1.2 smd: 1(-0.95,-1.2) 2(0,-1.2) 3(0.95,-1.2) 4(0.95,1.2) 5(0,1.2) 6(-0.95,1.2)

## Nets
As in the schematic.

Pads without a net: H11 3 4; H13 5 6; H14 5 6; P2 7 8; SW7 4 5; U16 2; U20 4; U28 1; U29 1; U30 1; U31 1

## Via types
v1: diameter 0.61, hole 0.305, Top Layer to Bottom Layer, 223 vias

## Routing (per net, layer and track width the routed paths; a pad name or vN(x,y) marks a point on that pad's centre or on a via; arc(x,y) is an arc through that point)
3V3: length 185.1
  Top Layer w0.254: C11.1 35.16,23.6 C10.2 33.37,23.41 U20.5 ; C11.1 35.67,24.2 33.86,26.02 v1(24.46,26.02) ; C11.1 42.78,24.11 R14.1 58.46,24.14 60.4,22.21 68.15,22.21 68.4,22.46 68.4,23.98 R37.1 68.4,25.75 68.4,29.08 R38.1 68.4,30.84 68.4,34.25 R39.1 68.4,36.05 68.4,39.22 R40.1 67.38,41.33 66.99,41.73 58.72,41.73 51.07,49.38 45.41,49.38 P2.1 42.49,49.26 28.14,49.26 27.38,48.5 27.38,44.43 P1.7 ; v1(21.41,15.22) 21.41,11.41 23.95,8.87 23.95,1.25 24.71,0.49 31.19,0.49 H14.2 34.05,0.43 57.93,0.43 H13.2
  Bottom Layer w0.254: v1(21.41,15.22) 21.41,22.97 v1(24.46,26.02)
5V: length 125
  Top Layer w0.254: H1.2 9.6,43.29 14.68,43.29 15.06,42.91 15.06,39.71 15.8,38.97 19.89,38.97 20.4,38.46 20.4,34.07 D4.1 ; R6.2 22.88,20.56 22.9,20.53 ; 13.35,25.83 13.28,25.76 v1(12.27,25.76)
  Top Layer w0.508: 22.9,14.13 22.9,23.89 ; 22.9,14.13 22.9,11.19 23.95,10.14 U33.1 U33.3 ; 22.9,14.13 58.93,14.13 60.27,15.47 60.27,20.17 61.8,21.7 64.72,21.7 U16.9 ; 22.9,23.89 C8.1 26.93,23.89 C9.2 27.41,23.41 U20.1 29.99,23.41 30.43,22.97 30.43,21.95 29.99,21.51 U20.3 ; 22.9,23.89 C44.1
  Bottom Layer w0.254: C44.1 20.14,26.65 18.11,26.65 17.22,25.76 v1(12.27,25.76)
GND:
  vias: v1(6.93,13.57) v1(6.93,12.81) v1(6.93,12.05) v1(6.93,11.28) v1(7.57,26.91) v1(7.69,13.57) v1(7.69,12.81) v1(7.69,12.05) v1(7.69,11.28) v1(8.46,13.57) v1(8.46,12.81) v1(8.46,12.05) v1(8.46,11.28) v1(9.22,13.57) v1(9.22,12.81) v1(9.22,12.05) v1(9.22,11.28) v1(9.98,13.57) v1(9.98,12.81) v1(9.98,12.05) v1(9.98,11.28) v1(11.5,15.09) v1(12.14,16.11) v1(12.14,13.95) v1(12.9,16.62) v1(12.9,13.44) v1(13.28,27.03) v1(15.25,27.03) v1(16.22,29.83) v1(16.34,24.63) v1(16.34,22.78) v1(16.33,20.94) v1(16.46,44.69) v1(17.09,23.73) v1(17.06,21.82) v1(17.47,43.54) v1(17.73,30.84) v1(17.67,28.55) v1(17.68,25.38) v1(17.98,24.49) v1(18.62,42.4) v1(18.74,45.07) v1(18.87,24.11) v1(19.25,8.62) v1(19.25,7.86) v1(19.25,7.09) v1(19.25,6.33) v1(19.25,5.57) v1(19.63,44.18) v1(19.76,24.49) v1(19.89,41) v1(20.01,8.62) v1(20.01,7.86) v1(20.01,7.09) v1(20.01,6.33) v1(20.01,5.57) v1(20.65,43.03) v1(20.65,17.89) v1(20.78,8.62) v1(20.78,7.86) v1(20.78,7.09) v1(20.78,6.33) v1(20.78,5.57) v1(21.03,39.73) v1(21.54,8.62) v1(21.54,7.86) v1(21.54,7.09) v1(21.54,6.33) v1(21.54,5.57) v1(22.17,41.64) v1(22.17,38.59) v1(24.08,39.99) v1(24.06,20.52) v1(24.38,38.59) v1(24.71,42.53) v1(25.22,19.16) v1(26.4,22.08) v1(26.36,20.43) v1(27.22,38.59) v1(27.34,21.15) v1(28.19,42.53) v1(28.27,22.08) v1(28.52,46.08) v1(29.07,39.99) v1(29.78,46.08) v1(30.22,38.59) v1(31.17,46.08) v1(32.71,39.99) v1(32.71,22.21) v1(33.09,34.65) v1(33.56,21.3) v1(34.5,22.21) v1(34.53,20.75) v1(35.63,34.65) v1(35.63,31.1) v1(35.63,28.81) v1(35.63,19.41) v1(36.89,20.75) v1(37.16,29.83) v1(37.64,26.91) v1(38.25,34.65) v1(38.27,31.1) v1(38.43,28.56) v1(39.7,29.83) v1(40.62,28.56) v1(40.72,34.65) v1(40.82,31.1) v1(40.84,26.91) v1(41.7,29.83) v1(42.83,28.56) v1(43.13,31.35) v1(43.24,34.64) v1(43.87,29.83) v1(44.53,26.78) v1(44.65,35.67) v1(44.65,32.87) v1(45.17,28.56) v1(45.67,31.35) v1(45.79,36.94) v1(46.05,34.27) v1(46.3,47.1) v1(46.43,29.83) v1(47.06,32.87) v1(47.19,35.54) v1(47.33,26.78) v1(47.57,28.56) v1(48.19,47.1) v1(48.34,36.94) v1(48.34,34.27) v1(48.65,29.83) v1(49.6,35.54) v1(49.6,32.87) v1(50.01,28.56) v1(50.35,47.1) v1(50.6,27.03) v1(50.79,34.27) v1(50.91,36.94) v1(51.08,29.83) v1(52.02,32.87) v1(52.08,35.54) v1(52.4,28.56) v1(52.91,46.72) v1(53.33,34.27) v1(53.41,36.94) v1(53.54,27.03) v1(53.57,29.83) v1(53.8,45.83) v1(54.6,35.54) v1(54.58,32.87) v1(54.69,44.94) v1(54.72,28.56) v1(55.57,44.05) v1(55.57,29.83) v1(55.91,34.27) v1(55.97,36.94) v1(56.34,43.16) v1(56.84,27.03) v1(56.91,28.56) v1(56.97,32.87) v1(57.15,35.54) v1(58.08,29.83) v1(58.25,34.27) v1(58.63,25.38) v1(58.74,36.94) v1(58.88,27.29) v1(59.38,35.54) v1(59.42,32.87) v1(59.51,28.43) v1(60.05,26.08) v1(60.41,29.83) v1(60.4,23.48) v1(60.53,38.59) v1(60.65,36.56) v1(60.65,34.27) v1(61.8,37.7) v1(63.83,39.87) v1(63.96,34.7) v1(63.96,29.54) v1(63.96,24.36)
VCCBAT:
  vias: v1(6.55,24.36) v1(6.55,23.35) v1(6.55,22.33) v1(6.55,21.32) v1(6.55,20.3) v1(6.55,19.28) v1(7.57,24.36) v1(7.57,23.35) v1(7.57,22.33) v1(7.57,21.32) v1(7.57,20.3) v1(7.57,19.28) v1(8.58,24.36) v1(8.58,23.35) v1(8.58,22.33) v1(8.58,21.32) v1(8.58,20.3) v1(8.58,19.28) v1(9.6,24.36) v1(9.6,23.35) v1(9.6,22.33) v1(9.6,21.32) v1(9.6,20.3) v1(9.6,19.28) v1(10.62,24.36) v1(10.62,23.35) v1(10.62,22.33) v1(10.62,21.32) v1(10.62,20.3) v1(10.62,19.28) v1(11.63,24.36) v1(11.63,23.35) v1(11.63,22.33) v1(11.63,21.32) v1(11.63,20.3) v1(11.63,19.28)
VIN: length 22.3
  Top Layer w0.254: D3.1 7.54,35.62 SW7.3 0.58,33.01 0.58,22.71 2.5,20.8 Q1.3
00.9: length 15.7
  Top Layer w0.254: U33.5 39.44,8.62 38.05,7.22 31.95,7.22 31.32,6.59 31.32,3.16 H14.4
02.8: length 15.8
  Top Layer w0.254: H14.3 30.05,7.09 31.19,8.24 37.41,8.24 38.18,9 38.18,11.41 U33.6
11.9: length 7.3
  Top Layer w0.254: C26.2 U33.37
  Bottom Layer w0.254: v1(36.91,32.87) U33.37
11.10: length 29.3
  Top Layer w0.254: H11.6 12.65,45.57 16.97,45.57 23.19,39.35 35.63,39.35 U33.38
11.11: length 7.3
  Top Layer w0.254: U33.39 34.38,38.07 C25.2
  Bottom Layer w0.254: U33.39 34.39,38.05 v1(34.39,32.86)
11.12: length 23.2
  Top Layer w0.254: H11.5 14.68,46.08 18.87,46.08 24.33,40.62 U33.40
13.0: length 7.3
  Top Layer w0.254: C28.2 U33.33
  Bottom Layer w0.254: v1(41.99,32.87) U33.33
13.1: length 27.2
  Top Layer w0.254: U33.34 40.84,41.76 24.4,41.76 18.82,47.35 R13.1
13.2: length 7.3
  Top Layer w0.254: C27.2 U33.35
  Bottom Layer w0.254: v1(39.44,32.87) U33.35
15.0: length 18.7
  Top Layer w0.254: P1.3 38.86,42.86 49.78,42.86 50.88,41.76 50.88,39.35 49.6,38.08
15.1: length 16.3
  Top Layer w0.254: 49.6,40.62 47.72,42.5 36.68,42.5 34.87,44.3
15.2: length 16.3
  Bottom Layer w0.254: U33.29 48.34,39.35 48.34,44.56 47.32,45.57 41.22,45.57 P1.2
15.3: length 18.8
  Top Layer w0.254: U33.30 45.54,42.14 31.95,42.14 P1.6
15.4: length 9.5
  Bottom Layer w0.254: U33.31 45.79,39.35 45.79,43.29 44.78,44.3 P1.1
15.5: length 13.7
  Bottom Layer w0.254: U33.32 42.87,42.27 34.37,42.27 P1.5
15.8: length 14.8
  Bottom Layer w0.254: U33.15 53.41,11.41 53.41,13.44 55.07,15.09 U16.6
20.11: length 24.2
  Top Layer w0.254: U33.23 55.83,39.22 55.83,42.65 52.17,46.31 40.36,46.31 P2.3
20.12: length 25.5
  Top Layer w0.254: P2.5 35.63,45.95 52.02,45.95 54.69,43.29 U33.24
20.13: length 30.3
  Top Layer w0.254: P2.6 33.48,45.57 51.89,45.57 53.41,44.05 53.41,39.35 U33.25
20.14: length 21.6
  Bottom Layer w0.254: U33.26 52.15,45.19 51.38,45.95 38.18,45.95 P2.4
22.0: length 17.6
  Bottom Layer w0.254: U16.5 64.97,13.82 64.97,9.51 63.83,8.36 56.46,8.36 U33.17
22.1: length 15.7
  Top Layer w0.254: U16.1 65.1,11.16 60.78,11.16 58.5,8.87 56.59,8.87 55.96,9.51 55.96,11.41 U33.18
22.2: length 7.5
  Top Layer w0.254: U16.4 59.64,12.55 U33.19
22.3: length 9.9
  Top Layer w0.254: U16.3 65.1,13.7 60.02,13.7 59,12.68 U33.20
23.1: length 18.4
  Bottom Layer w0.254: U16.10 53.29,20.17 52.15,19.03 U33.16
33.0: length 11.5
  Top Layer w0.254: R11.1 37.54,2.47 37.54,5.06 38.05,5.57 39.57,5.57 41.99,7.98 U33.7
33.1: length 11.3
  Top Layer w0.254: R9.1 36.79,5.7 37.41,6.33 38.81,6.33 40.72,8.24 40.72,11.41 U33.8
33.3: length 6.8
  Top Layer w0.254: v1(47.15,15.6) R15.1
  Bottom Layer w0.254: v1(47.15,15.6) 45.16,15.6 44.53,14.97 U33.10
33.4: length 9.6
  Top Layer w0.254: U33.11 47.06,7.47 49.22,5.31 49.22,2.57 R12.2
33.5: length 9.6
  Top Layer w0.254: U33.12 48.34,11.41 48.34,8.11 50.03,6.41 R10.2
33.6: length 13.5
  Top Layer w0.254: 49.6,10.14 49.6,8.62 50.88,7.35 54.56,7.35 55.45,6.46 55.45,3.03 H13.4
33.7: length 13.4
  Top Layer w0.254: H13.3 56.72,6.97 55.19,8.49 51.64,8.49 50.88,9.25 50.88,11.41 49.6,12.68
$1N756: length 9.6
  Top Layer w0.254: SW7.2 1.6,31.02 1.6,26.4 2.5,25.5 Q1.1
$1N757: length 7.2
  Top Layer w0.254: D3.2 R1.1 7.51,29.62 SW7.1
$1N1936: length 1.7
  Top Layer w0.254: LED4.2 19.9,15.22 R8.1
$1N2039: length 8.5
  Top Layer w0.254: H1.1 9.73,48.24 15.2,48.24 R13.2
$1N2442: length 6.4
  Top Layer w0.254: R14.2 48.9,25.65 BUZZER3.1
$1N2446: length 5.7
  Top Layer w0.254: BUZZER3.2 52.38,17.56 Q2.3
$1N2966: length 2.6
  Top Layer w0.254: R9.2 38.31,4.3 H12.5
$1N2968: length 2.5
  Top Layer w0.254: 48.53,4.3 H12.1
$1N2969: length 2.6
  Top Layer w0.254: H12.6 40.85,1.71 R11.2
$1N2971: length 2.5
  Top Layer w0.254: 48.53,1.76 H12.2
$1N3489: length 1.5
  Top Layer w0.254: SW8.1 67.44,23.29 R37.2
$1N3490: length 1.5
  Top Layer w0.254: SW9.1 67.52,28.45 R38.2
$1N3491: length 1.5
  Top Layer w0.254: R39.2 67.48,33.62 SW10.1
$1N3492: length 1.5
  Top Layer w0.254: SW11.1 67.33,38.78 R40.2
$1N3494: length 26.2
  Top Layer w0.254: R42.1 39.07,29.19 60.99,29.19 61.73,28.45 SW9.2
$1N3495: length 24.1
  Top Layer w0.254: SW10.2 61.84,33.64 46.68,33.64 43.51,30.46 40.34,30.46 R43.1
$1N3496: length 22.8
  Top Layer w0.254: R44.1 46.8,36.18 59.12,36.18 SW11.2
$1N3497: length 30.8
  Top Layer w0.254: R41.1 37.95,27.79 57.35,27.79 SW8.2
$1N3677: length 1.8
  Top Layer w0.254: R15.2 50.17,17.23 Q2.1
$1N27934: length 1.6
  Top Layer w0.254: R6.1 19.9,18.91 LED1.2
$1N27940: length 1.7
  Top Layer w0.254: C42.2 13.29,28.17 13.35,28.23

## Copper pours and planes (outline as drawn; the poured copper is in the pictures)
5V on Top Layer: 17.47,33.38 17.6,33.51 19.89,33.51 20.01,33.38 20.01,31.33 20.66,30.69 20.66,27.53 22.3,25.89 22.3,24.87 21.92,24.49 20.9,24.49 20.52,24.87 20.52,26.02 18.87,27.67 18.87,30.59 18.11,31.35 17.6,31.35 17.47,31.48
GND on Top Layer: -0.05,50.02 70.05,50.02 70.05,-0.02 -0.05,-0.02
GND on Bottom Layer: -0.05,50.15 70.05,50.15 70.05,0.11 -0.05,0.11
VCCBAT on Top Layer: 14.3,18.12 13.77,18.65 5.79,18.65 5.66,18.78 5.66,24.75 13.7,24.75 13.86,24.91 13.86,26.34 14.04,26.52 15.57,26.52 15.7,26.4 15.7,24.65 15.45,24.4 15.45,20.93 17.22,19.16 17.22,2.39 15.82,1 8.25,1 7.91,1.34 7.91,4.89 8.46,5.44 13.54,5.44 14.3,6.2
VIN on Top Layer: 0,20.44 5.03,20.44 5.03,13.19 0,13.19
$1N27939 on Top Layer: 13.92,27.67 14.04,27.54 14.55,27.54 14.68,27.67 14.68,32.37 14.55,32.49 10.11,32.49 9.85,32.24 9.85,27.67 9.98,27.54 10.74,27.54 10.87,27.67 10.87,29.32 11.38,29.83 13.66,29.83 13.92,29.57
$1N27942 on Top Layer: 11.38,38.33 19.89,38.33 19.89,35.92 11.38,35.92

Small or netless copper shapes (teardrops, artwork), in the pictures only: 141 on Top Layer, 28 on Bottom Layer

## Text on the board
Bottom Silkscreen Layer: 前车MAINBOARD_V3.2
Top Layer: Origin 20th | 2025/4/6 | 华东理工大学
Top Solder Mask Layer: Origin 20th | 2025/4/6 | 华东理工大学
Top Silkscreen Layer: BLDC | ENCODER | MOTOR | TFTLCD | IMU660 | WIFISPI | 5V | 3V3 | LED | OFF | ON
